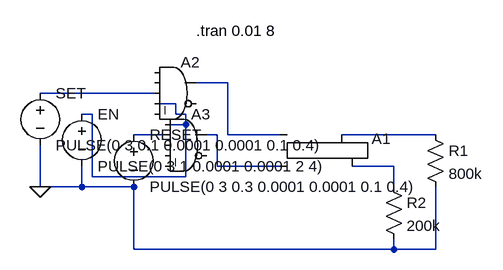
[diagram p0: schematic GatedSRlatch.asc]
GatedSRlatch.asc, the LTspice schematic file:
Version 4
SHEET 1 880 680
WIRE 368 192 320 192
WIRE 256 208 80 208
WIRE 288 224 256 224
WIRE 160 240 144 240
WIRE 288 240 288 224
WIRE 304 240 288 240
WIRE 304 256 304 240
WIRE 304 256 272 256
WIRE 272 272 224 272
WIRE 352 272 336 272
WIRE 368 272 368 192
WIRE 448 272 368 272
WIRE 688 272 544 272
WIRE 352 320 352 272
WIRE 448 320 352 320
WIRE 624 320 560 320
WIRE 160 336 160 240
WIRE 304 336 304 256
WIRE 304 336 160 336
WIRE 80 352 80 288
WIRE 144 352 144 320
WIRE 144 352 80 352
WIRE 224 352 144 352
WIRE 624 352 624 320
WIRE 224 448 224 352
WIRE 624 448 624 432
WIRE 624 448 224 448
WIRE 688 448 688 352
WIRE 688 448 624 448
FLAG 80 352 0
SYMBOL Digital/srflop 496 224 R0
SYMATTR InstName A1
SYMBOL voltage 224 256 R0
SYMATTR InstName RESET
SYMATTR Value PULSE(0 3 0.3 0.0001 0.0001 0.1 0.4)
SYMBOL voltage 80 192 R0
SYMATTR InstName SET
SYMATTR Value PULSE(0 3 0.1 0.0001 0.0001 0.1 0.4)
SYMBOL res 672 256 R0
SYMATTR InstName R1
SYMATTR Value 800k
SYMBOL res 608 336 R0
SYMATTR InstName R2
SYMATTR Value 200k
SYMBOL Digital/and 288 144 R0
SYMATTR InstName A2
SYMBOL Digital/and 304 224 R0
SYMATTR InstName A3
SYMBOL voltage 144 224 R0
SYMATTR InstName EN
SYMATTR Value PULSE(0 3 1 0.0001 0.0001 2 4)
TEXT 320 112 Left 2 !.tran 0.01 8

The netlist it stands for:
* GatedSRlatch.asc
A1 N001 N005 0 0 0 N007 N006 0 SRFLOP
V§RESET N004 0 PULSE(0 3 0.3 0.0001 0.0001 0.1 0.4)
V§SET N002 0 PULSE(0 3 0.1 0.0001 0.0001 0.1 0.4)
R1 N006 0 800k
R2 N007 0 200k
A2 0 0 N002 N003 0 0 N001 0 AND
A3 N003 N004 0 0 0 0 N005 0 AND
V§EN N003 0 PULSE(0 3 1 0.0001 0.0001 2 4)
.tran 0.01 8
.backanno
.end